# EAGLE design Brundage Business Card - REV 1.0 (EAGLE 9.0.1)
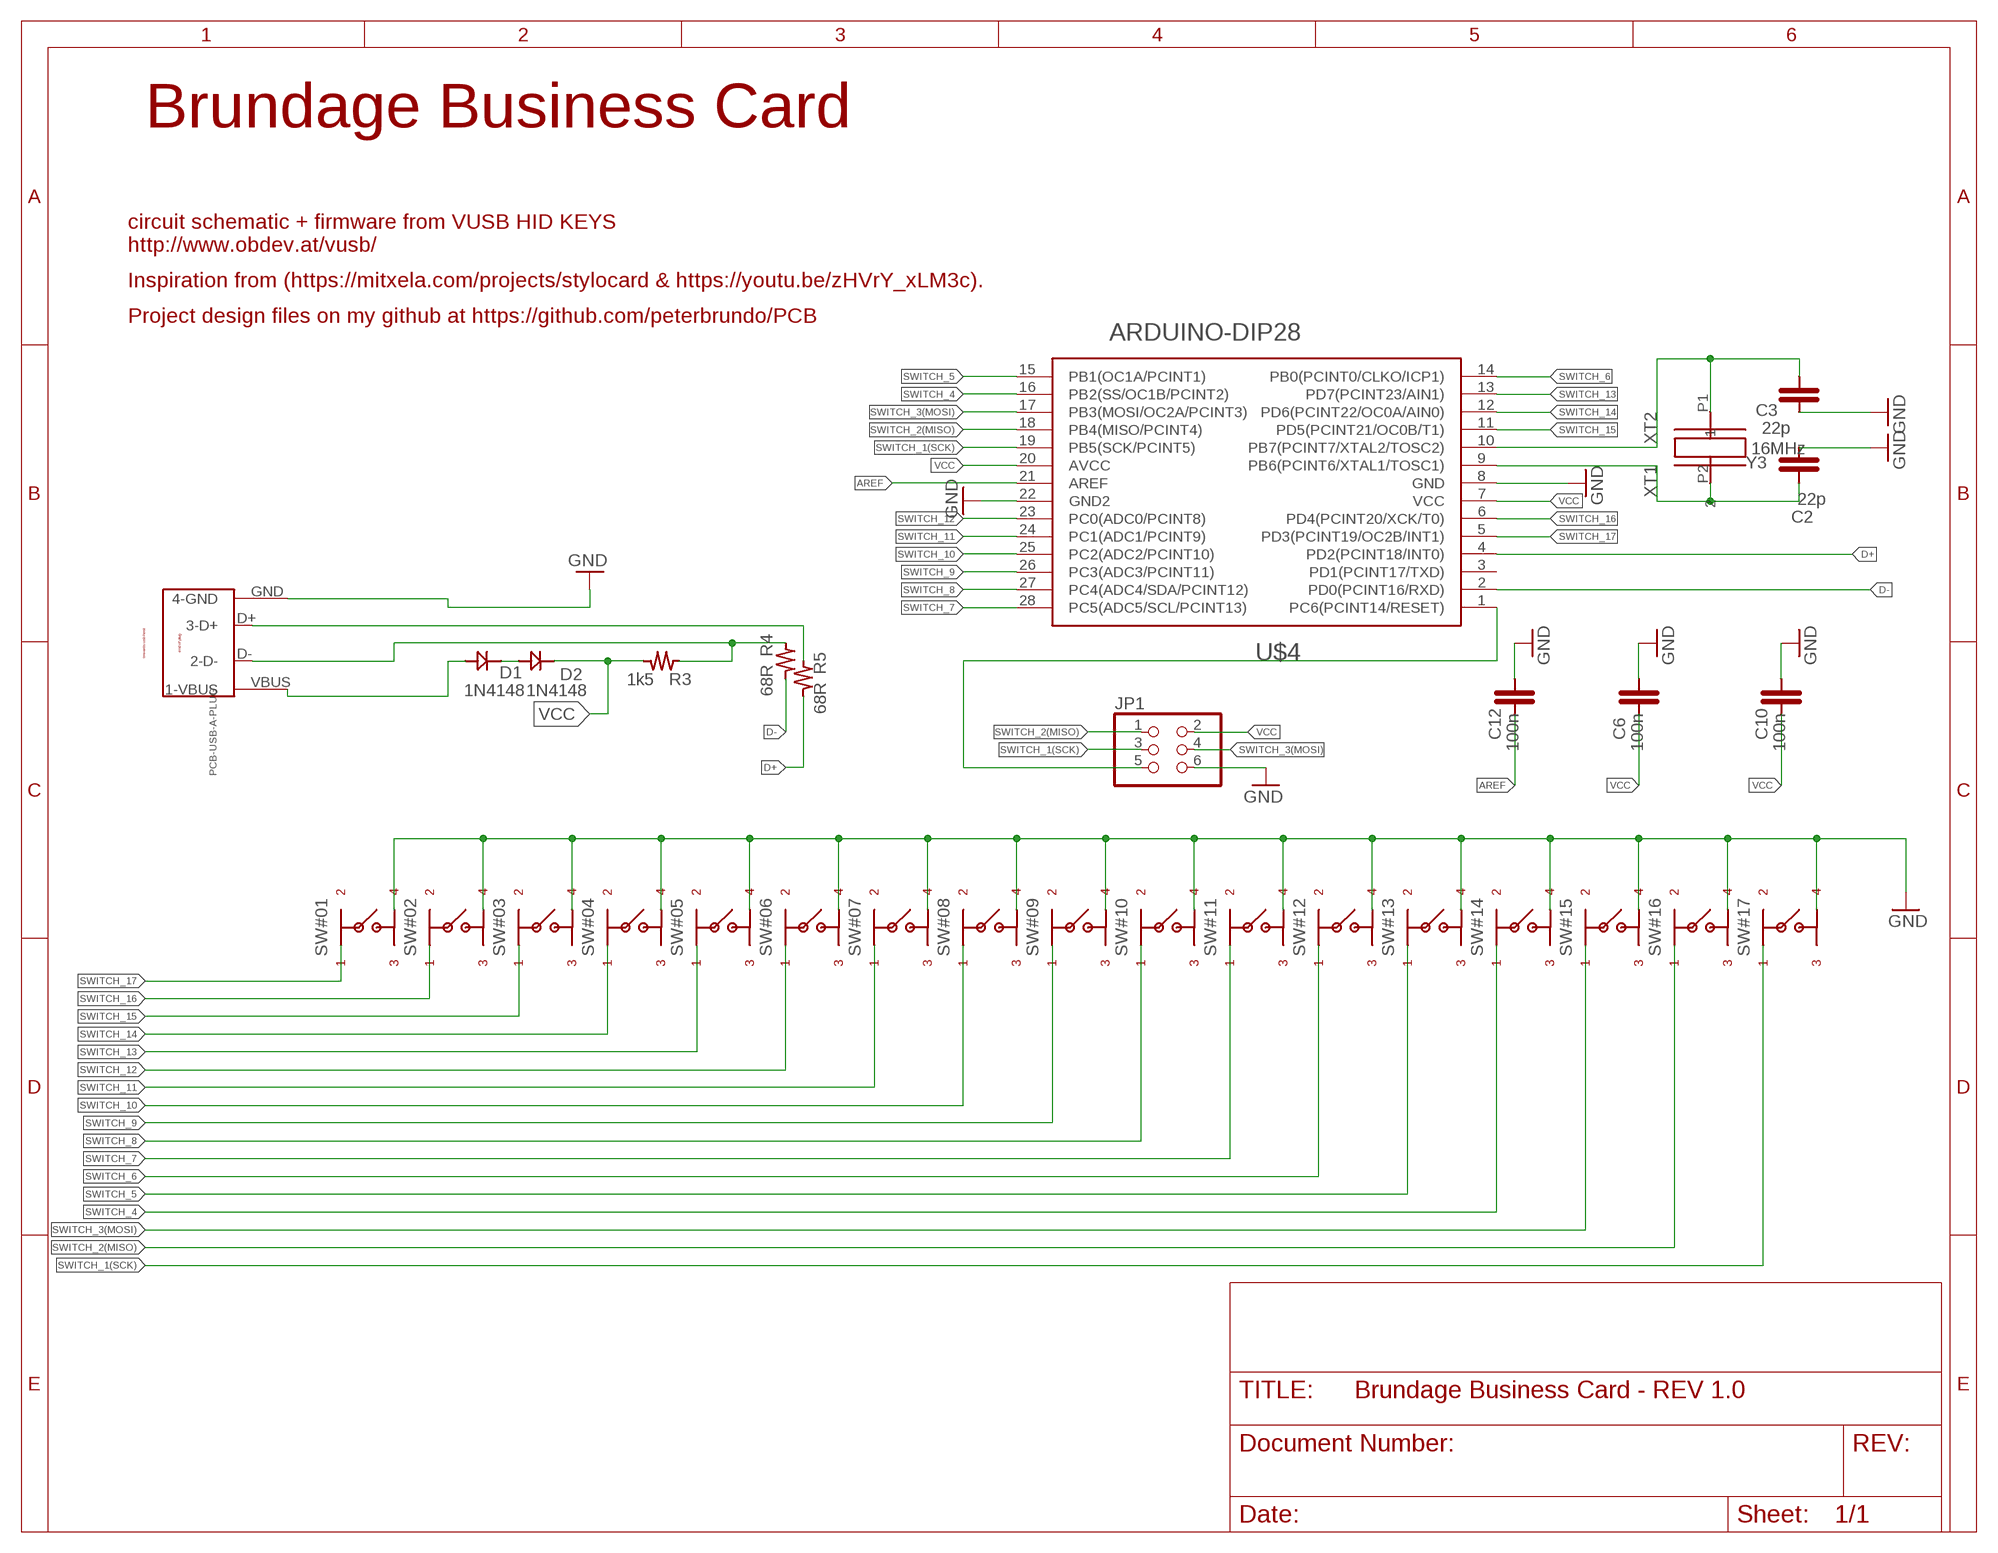
[diagram p0: schematic, sheet 1]

## Parts
C2  22p  GRM0225C1E220GA02L  [GRM0225C1E220GA02L]
C3  22p  GRM0225C1E220GA02L  [GRM0225C1E220GA02L]
C6  100n  GMK063BJ104KP-F  [GMK063BJ104KP-F]
C10  100n  GMK063BJ104KP-F  [GMK063BJ104KP-F]
C12  100n  GMK063BJ104KP-F  [GMK063BJ104KP-F]
D1  1N4148  [1N4148]
D2  1N4148  [1N4148]
JP1  PINHD-2X3  [2X03]
PCB-USB-A-PLUG  PCB/USB-SERIES"A"PLUG  [USB-SERIES-A-PLUG]
R3  1k5  CRCW06031K50FKEAC  [CRCW06031K50FKEAC]
R4  68R  RCS060368R0FKEA  [RCS060368R0FKEA]
R5  68R  RCS060368R0FKEA  [RCS060368R0FKEA]
SW#01  PTS647SM38SMTR2LFS  [PTS647SM38SMTR2LFS]
SW#02  PTS647SM38SMTR2LFS  [PTS647SM38SMTR2LFS]
SW#03  PTS647SM38SMTR2LFS  [PTS647SM38SMTR2LFS]
SW#04  PTS647SM38SMTR2LFS  [PTS647SM38SMTR2LFS]
SW#05  PTS647SM38SMTR2LFS  [PTS647SM38SMTR2LFS]
SW#06  PTS647SM38SMTR2LFS  [PTS647SM38SMTR2LFS]
SW#07  PTS647SM38SMTR2LFS  [PTS647SM38SMTR2LFS]
SW#08  PTS647SM38SMTR2LFS  [PTS647SM38SMTR2LFS]
SW#09  PTS647SM38SMTR2LFS  [PTS647SM38SMTR2LFS]
SW#10  PTS647SM38SMTR2LFS  [PTS647SM38SMTR2LFS]
SW#11  PTS647SM38SMTR2LFS  [PTS647SM38SMTR2LFS]
SW#12  PTS647SM38SMTR2LFS  [PTS647SM38SMTR2LFS]
SW#13  PTS647SM38SMTR2LFS  [PTS647SM38SMTR2LFS]
SW#14  PTS647SM38SMTR2LFS  [PTS647SM38SMTR2LFS]
SW#15  PTS647SM38SMTR2LFS  [PTS647SM38SMTR2LFS]
SW#16  PTS647SM38SMTR2LFS  [PTS647SM38SMTR2LFS]
SW#17  PTS647SM38SMTR2LFS  [PTS647SM38SMTR2LFS]
U$4  ARDUINO-DIP28  [DIL28-3]
Y3  16MHz  ABL-8.000MHZ-B2  [ABL-8.000MHZ-B2]

## Nets
AREF [aref]: C12.P2 U$4.21(AREF)
D+: R5.P2 U$4.4(PD2(PCINT18/INT0))
D-: R4.P2 U$4.2(PD0(PCINT16/RXD))
GND [gnd]: C2.P2 C3.P2 C6.P1 C10.P1 C12.P1 JP1.6 PCB-USB-A-PLUG.GND(4-GND) SW#01.4 SW#02.4 SW#03.4 SW#04.4 SW#05.4 SW#06.4 SW#07.4 SW#08.4 SW#09.4 SW#10.4 SW#11.4 SW#12.4 SW#13.4 SW#14.4 SW#15.4 SW#16.4 SW#17.4 U$4.8(GND) U$4.22(GND2)
N$25: PCB-USB-A-PLUG.D+(3-D+) R5.P1
N$27 [usbvcc]: PCB-USB-A-PLUG.D-(2-D-) R3.P1 R4.P1
N$28 [usbvcc]: D1.ANODE(+) PCB-USB-A-PLUG.VBUS(1-VBUS)
N$29 [usbvcc]: D1.CATHODE(-) D2.ANODE(+)
N$52: JP1.5 U$4.1(PC6(PCINT14/RESET))
SWITCH_1(SCK): JP1.3 SW#17.1 U$4.19(PB5(SCK/PCINT5))
SWITCH_2(MISO): JP1.1 SW#16.1 U$4.18(PB4(MISO/PCINT4))
SWITCH_3(MOSI): JP1.4 SW#15.1 U$4.17(PB3(MOSI/OC2A/PCINT3))
SWITCH_4: SW#14.1 U$4.16(PB2(SS/OC1B/PCINT2))
SWITCH_5: SW#13.1 U$4.15(PB1(OC1A/PCINT1))
SWITCH_6: SW#12.1 U$4.14(PB0(PCINT0/CLKO/ICP1))
SWITCH_7: SW#11.1 U$4.28(PC5(ADC5/SCL/PCINT13))
SWITCH_8: SW#10.1 U$4.27(PC4(ADC4/SDA/PCINT12))
SWITCH_9: SW#09.1 U$4.26(PC3(ADC3/PCINT11))
SWITCH_10: SW#08.1 U$4.25(PC2(ADC2/PCINT10))
SWITCH_11: SW#07.1 U$4.24(PC1(ADC1/PCINT9))
SWITCH_12: SW#06.1 U$4.23(PC0(ADC0/PCINT8))
SWITCH_13: SW#05.1 U$4.13(PD7(PCINT23/AIN1))
SWITCH_14: SW#04.1 U$4.12(PD6(PCINT22/OC0A/AIN0))
SWITCH_15: SW#03.1 U$4.11(PD5(PCINT21/OC0B/T1))
SWITCH_16: SW#02.1 U$4.6(PD4(PCINT20/XCK/T0))
SWITCH_17: SW#01.1 U$4.5(PD3(PCINT19/OC2B/INT1))
VCC [usbvcc]: C6.P2 C10.P2 D2.CATHODE(-) JP1.2 R3.P2 U$4.7(VCC) U$4.20(AVCC)
XT1: C2.P1 U$4.9(PB6(PCINT6/XTAL1/TOSC1)) Y3.P2
XT2: C3.P1 U$4.10(PB7(PCINT7/XTAL2/TOSC2)) Y3.P1
Unconnected: SW#01.2 SW#01.3 SW#02.2 SW#02.3 SW#03.2 SW#03.3 SW#04.2 SW#04.3 SW#05.2 SW#05.3 SW#06.2 SW#06.3 SW#07.2 SW#07.3 SW#08.2 SW#08.3 SW#09.2 SW#09.3 SW#10.2 SW#10.3 SW#11.2 SW#11.3 SW#12.2 SW#12.3 SW#13.2 SW#13.3 SW#14.2 SW#14.3 SW#15.2 SW#15.3 SW#16.2 SW#16.3 SW#17.2 SW#17.3 U$4.3(PD1(PCINT17/TXD))

## Notes on the sheet
- Brundage Business Card
- circuit schematic + firmware from VUSB HID KEYS 
  http://www.obdev.at/vusb/
- Inspiration from (https://mitxela.com/projects/stylocard & https://youtu.be/zHVrY_xLM3c).
- Project design files on my github at https://github.com/peterbrundo/PCB

## Library data of the parts
C2 C3 = Brundage Buisness Card:GRM0225C1E220GA02L
C6 C10 C12 = Brundage Buisness Card:GMK063BJ104KP-F
D1 D2 = Brundage Buisness Card:1N4148
JP1 = pinhead:PINHD-2X3: PIN HEADER
PCB-USB-A-PLUG = Brundage Buisness Card:PCB/USB-SERIES"A"PLUG
R3 = Brundage Buisness Card:CRCW06031K50FKEAC
R4 R5 = Brundage Buisness Card:RCS060368R0FKEA
SW#01-SW#09 SW#10-SW#17 = Brundage Buisness Card:PTS647SM38SMTR2LFS
U$4 = Brundage Buisness Card:ARDUINO-DIP28
Y3 = Brundage Buisness Card:ABL-8.000MHZ-B2

## Net classes
0 default: clearance 0.152 mm
2 gnd: width 0.025 mm, drill 0.559 mm, clearance 0.152 mm to class 0, clearance 0.152 mm
3 usbvcc: width 0.025 mm, drill 0.61 mm, clearance 0.152 mm to class 0, clearance 0.254 mm
4 aref: width 0.025 mm, drill 0.61 mm, clearance 0.152 mm to class 0, clearance 0.254 mm
6 lol text: clearance 0.152 mm to class 0, clearance 0.127 mm

## Board
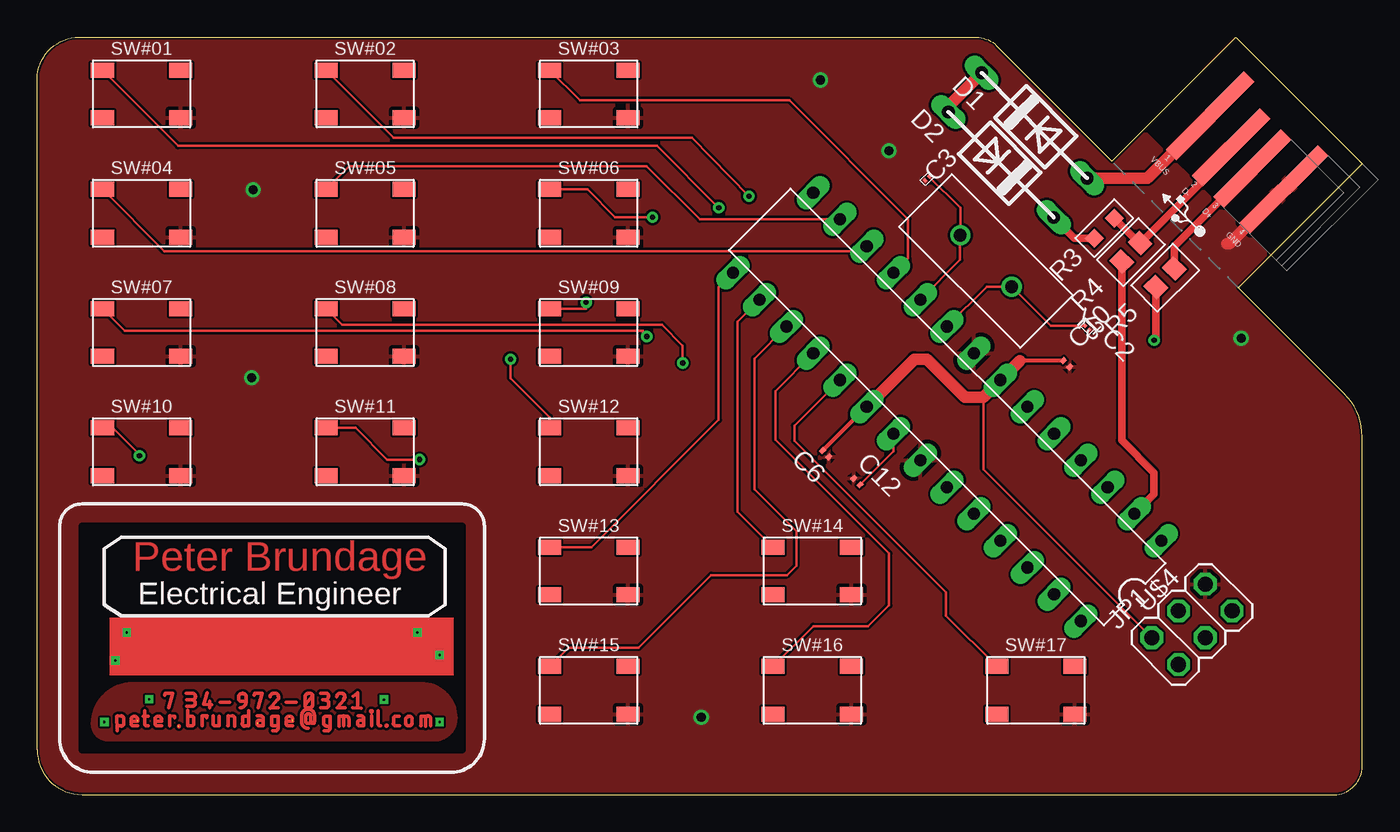
[diagram p1: board, top side]
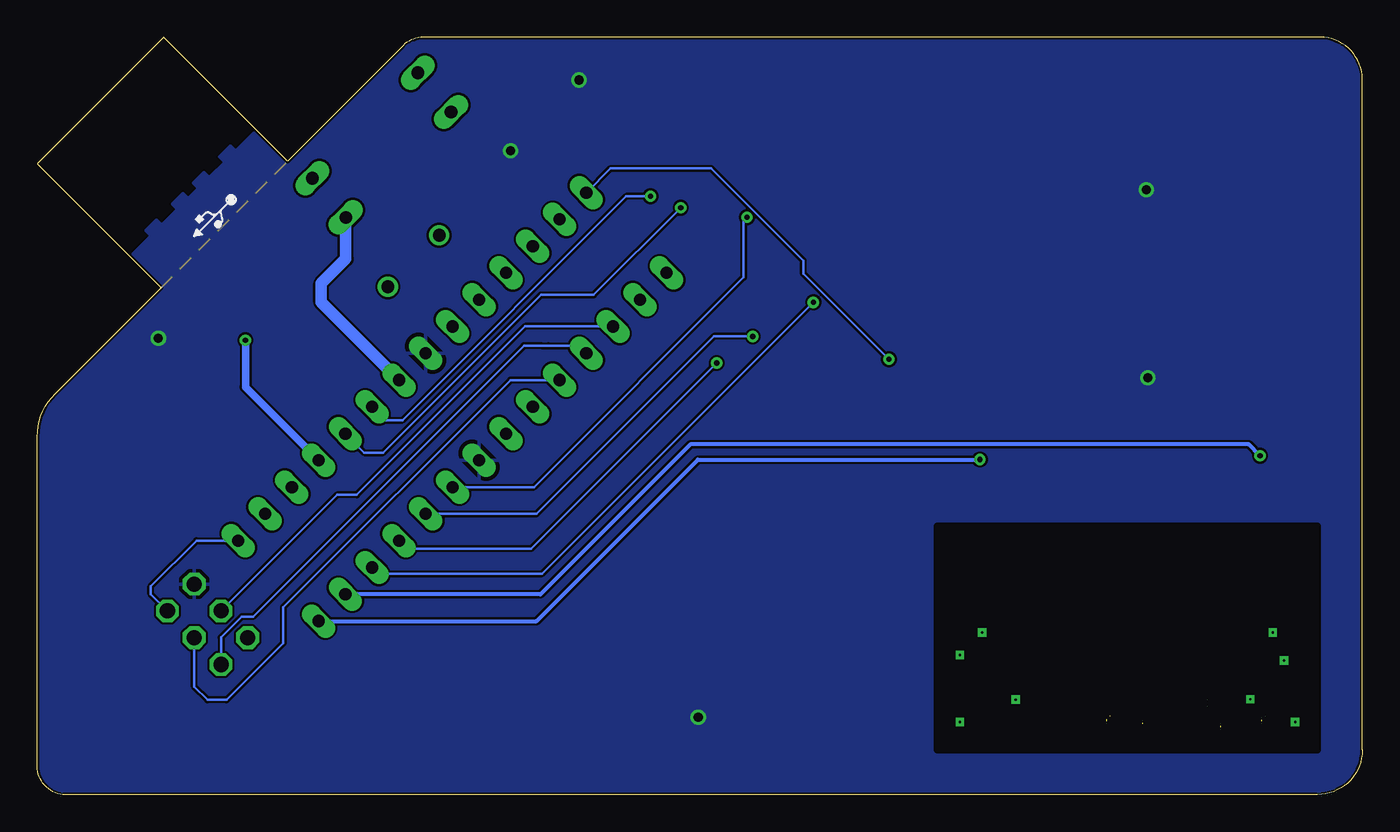
[diagram p2: board, bottom side, seen from below]

Size 88.9 x 50.8 mm. Coordinates in mm from the lower left corner, seen from the top.
Outline: 0,3 0,48 arc-90 2.8,50.8 63,50.8 arc-45 64.36,50.24 72.11,42.49 80.42,50.8 88.9,42.31 80.59,34.01 87.7,26.9 arc-45 88.9,24 88.9,1.9 arc-90 87,0 3,0 arc-90 0,3
Copper layers (1*16): Top 0.035mm / dielectric 1.5mm / Bottom 0.035mm
Design rules "default *": minimum track width 6mil, minimum drill 0.35mm, track to track 6mil, track to pad 6mil, pad to pad 6mil, via to via 6mil, smd to smd 6mil, copper to edge 6mil, drill to drill 6mil, minimum pad ring 10mil, minimum via ring 8mil, stop-mask expansion 4mil, vias tented up to drill 0mil, thermal gap 10mil
tRestrict: 4 lines
bRestrict: 4 lines

### Footprints (pad centres in the part's own frame; a part is rotated, then mirrored left to right if it is on the bottom)
GRM0225C1E220GA02L = smd 0.18 x 0.23: P1 -0.09,0; P2 0.29,0
GMK063BJ104KP-F = smd 0.3 x 0.4: P1 -0.3,0; P2 0.3,0
1N4148 = drill 0.85 long: ANODE(+) 0,0; CATHODE(-) 10,0
2X03 = drill 1.016 octagon: 1 -2.54,-1.27; 2 -2.54,1.27; 3 0,-1.27; 4 0,1.27; 5 2.54,-1.27; 6 2.54,1.27
USB-SERIES-A-PLUG = smd 1 x 6.41: D+ 5,-6.305; D- 7,-6.305 | smd 1 x 7.41: GND 2.5,-6.805; VBUS 9.5,-6.805
CRCW06031K50FKEAC = smd 0.9 x 0.9: P1 -0.95,0; P2 0.95,0
RCS060368R0FKEA = smd 1.1 x 1.25: P1 0,0; P2 1.75,0
PTS647SM38SMTR2LFS = smd 1.55 x 1: 1 -2.625,1.6; 2 2.625,1.6; 3 -2.625,-1.6; 4 2.625,-1.6
DIL28-3 = drill 0.813 long: 1 -16.51,-3.81; 2 -13.97,-3.81; 3 -11.43,-3.81; 4 -8.89,-3.81; 5 -6.35,-3.81; 6 -3.81,-3.81; 7 -1.27,-3.81; 8 1.27,-3.81; 9 3.81,-3.81; 10 6.35,-3.81; 11 8.89,-3.81; 12 11.43,-3.81; 13 13.97,-3.81; 14 16.51,-3.81; 15 16.51,3.81; 16 13.97,3.81; 17 11.43,3.81; 18 8.89,3.81; 19 6.35,3.81; 20 3.81,3.81; 21 1.27,3.81; 22 -1.27,3.81; 23 -3.81,3.81; 24 -6.35,3.81; 25 -8.89,3.81; 26 -11.43,3.81; 27 -13.97,3.81; 28 -16.51,3.81
ABL-8.000MHZ-B2 = drill 0.85: P1 -2.44,0; P2 2.44,0

### Placement (x,y rotation side)
C2  70.38,31.38 315 top
C3  59.78,41.4 225 top
C6  52.9,22.86 135 top
C10  69.06,28.9 135 top
C12  55,21 315 top
D1  70.44,41.35 135 top
D2  61.13,45.79 315 top
JP1  77.47,11.43 45 top
PCB-USB-A-PLUG  80.59,34.01 135 top
R3  71.59,38 225 top
R4  74,37 225 top
R5  76.29,35.29 225 top
SW#01  7,47 0 top
SW#02  22,47 0 top
SW#03  37,47 0 top
SW#04  7,39 0 top
SW#05  22,39 0 top
SW#06  37,39 0 top
SW#07  7,31 0 top
SW#08  22,31 0 top
SW#09  37,31 0 top
SW#10  7,23 0 top
SW#11  22,23 0 top
SW#12  37,23 0 top
SW#13  37,15 0 top
SW#14  52,15 0 top
SW#15  37,7 0 top
SW#16  52,7 0 top
SW#17  67,7 0 top
U$4  61.04,26.01 135 top
Y3  63.66,35.79 315 top

### Tracks (layer width: path | path; a pad name or v marks a point on that pad's centre or on a via)
AREF
  Top 0.152: C12.P2 57.45,23.03 U$4.21
D+  (via drill 0.35)
  Top 0.152: 75.06,30.61 v74.93,30.48
  Top 0.508: R5.P2 75.06,30.61
  Bottom 0.508: v74.93,30.48 74.93,27.33 U$4.4
D-
  Top 0.508: R4.P2 72.76,23.76 74.93,21.59 74.93,20.14 U$4.2
GND  (via drill 0.61)
  Top 0.762: PCB-USB-A-PLUG.GND 79.98,36.94 79.81,36.94
  other vias: 57.15,43.18 80.77,30.61 14.39,27.97 14.48,40.58 52.55,47.94 44.55,5.19
  pour Top: -9,54 -9,-9 96,-9 96,-3 88.88,54
  pour Bottom: -10.57,61.26 -10.57,-13.67 115.16,-13.67 115.16,61.26
LOOOOL
  pour Top: 25.77,7.49 6.4,7.49 arc90 3.67,4.76 arc90 4.79,3.64 26.62,3.64 arc90 28.12,5.14 arc90
N$1  (via drill 0.15)
  other vias: 27,9.38
N$2  (2 unrouted)
  Top 0.25: 9.53,4.62 9.49,4.62 arc90 9.48,4.61 | 9.48,4.57 arc90 9.5,4.55 | 9.52,4.55 arc90 9.53,4.56
N$3  (via drill 0.15)
  other vias: 4.5,4.88
N$4  (via drill 0.15)
  other vias: 27,4.88
N$5  (via drill 0.15)
  other vias: 23.25,6.38
N$6  (via drill 0.15)
  other vias: 25.5,10.88
N$7  (via drill 0.15)
  other vias: 5.25,9
N$8
  Top 0.25: 14.56,6.66 14.57,6.79 15.1,6.8 14.83,5.82
N$9  (via drill 0.15)
  other vias: 7.51,6.39
N$10  (2 unrouted)
  Top 0.25: 10,6.8 10.4,6.8 | 10.01,6.37 10.4,6.37 | 10.4,6.8 arc-180 10.4,6.37 | 10.4,6.8 arc-180 10.4,6.37 | 10.39,6.36 arc-180 10.39,5.93 | 10.01,5.93 10.4,5.93
N$11
  Top 0.25: 11.4,6.84 11.18,6.05 11.71,6.04 11.52,6.05 11.56,6.05 | 11.56,6.05 11.56,6.25 | 11.56,6.05 11.56,5.84
N$12
  Top 0.25: 12.27,6.2 12.92,6.2
N$13
  Top 0.25: 8.56,6.66 8.57,6.79 9.1,6.8 8.83,5.82
N$14
  Top 0.25: 15.61,5.83 16.16,5.83
N$15
  Top 0.25: 15.62,5.81 16.11,6.36
N$16
  Top 0.25: 16.71,6.21 17.38,6.2
N$17
  Top 0.25: 18.44,6.59 18.01,6.05
N$18  (2 unrouted)
  Top 0.25: 6.73,5.04 arc90 6.52,5.25 | 6.5,5.25 arc90 6.29,5.04 | 6.73,4.61 6.45,4.61 arc-90 6.29,4.77 6.29,4.93 6.74,4.93
N$19  (2 unrouted)
  Top 0.25: 17.14,5.05 arc90 16.93,5.26 | 16.91,5.26 arc90 16.7,5.05 | 17.14,4.62 16.86,4.62 arc-90 16.7,4.78 16.7,4.94 17.15,4.94
N$20
  Top 0.25: 16.15,5.27 16.15,4.45 arc-90 15.99,4.29 15.78,4.29
N$21
  Top 0.25: 16.14,4.63 15.88,4.63
N$22
  Top 0.25: 15.83,4.63 arc-90 15.71,4.75 15.71,5.14 arc-90 15.83,5.26 16.14,5.26
N$23
  Top 0.25: 18.22,6.8 arc90 17.97,6.55 17.97,5.97 arc90 18.12,5.82 18.26,5.82 arc90 18.47,6.03 18.47,6.65 arc90 18.33,6.79 18.13,6.79
N$24  (via drill 0.15)
  other vias: 6,10.88
N$25
  Top 0.508: PCB-USB-A-PLUG.D+ 76.29,36.78 R5.P1
N$26
  Top 0.25: 8.34,5.05 arc90 8.13,5.26 8.11,5.26 arc90 7.9,5.05 7.9,4.94 | 7.9,4.94 7.9,4.78 arc90 8.06,4.62 8.34,4.62 | 8.35,4.94 7.9,4.94
N$27
  Top 0.152: 73.93,37 R4.P1 | PCB-USB-A-PLUG.D- 80.1,43.1
  Top 0.508: R3.P1 73.93,37 | 80.1,43.1 R4.P1
N$28
  Top 0.762: PCB-USB-A-PLUG.VBUS 74.5,41.35 D1.ANODE(+)
N$29
  Top 0.508: 61.13,46.18 D2.ANODE(+)
  Top 0.762: D1.CATHODE(-) 61.13,46.18
N$30
  Top 0.25: 14.2,5.63 14.2,4.62
N$31
  Top 0.25: 14.18,4.63 13.94,4.62
N$32
  Top 0.25: 13.77,4.81 13.77,5.09
N$33
  Top 0.25: 13.91,5.26 14.19,5.27
N$34
  Top 0.25: 13.71,6.25 14.01,6.26 14.02,6.52
N$37
  Top 0.25: 12.81,5.28 12.8,4.61 12.81,4.62 12.79,4.61
N$38
  Top 0.25: 13.24,4.58 13.24,5.1
N$39
  Top 0.25: 13.07,5.28 12.81,5.27
N$40
  Top 0.25: 12.22,5.27 12.22,4.62 11.95,4.62
N$41
  Top 0.25: 11.79,5.31 11.79,4.78 11.79,4.77 arc90 11.95,4.61
N$42
  Top 0.25: 11.07,5.28 11.06,4.62
N$43
  Top 0.25: 11.38,5.27 11.38,5.16
N$44
  Top 0.25: 11.4,5.28 11.06,5.28
N$45
  Top 0.25: 10.08,5.65 10.09,4.63
N$46
  Top 0.25: 10.09,4.61 10.34,4.61
N$47
  Top 0.25: 10.51,4.8 10.51,5.09
N$48
  Top 0.25: 10.11,5.27 10.34,5.26
N$49
  Top 0.25: 8.9,5.28 8.89,4.63
N$50
  Top 0.25: 8.93,5.28 9.2,5.27
N$51
  Top 0.25: 9.23,5.25 9.22,5.16
N$52
  Bottom 0.152: JP1.5 81.28,13.44 81.28,13.97 78.22,17.03 U$4.1
N$56
  Top 0.25: 7.22,5.62 7.22,4.75 arc90 7.35,4.62
N$57
  Top 0.25: 7.38,4.63 7.43,4.63
N$58
  Top 0.25: 7.1,5.27 7.43,5.27
N$62
  Top 0.25: 5.34,5.27 5.35,4.29
N$63
  Top 0.25: 5.35,4.63 5.63,4.62
N$64
  Top 0.25: 5.79,4.78 5.79,5.08
N$65
  Top 0.25: 5.39,5.28 5.63,5.27
N$66
  Top 0.25: 5.63,5.28 arc-90 5.79,5.12 5.79,5.11
N$67
  Top 0.25: 5.63,4.6 arc90 5.81,4.78
N$73
  Top 0.25: 10.35,4.62 10.36,4.62 arc90 10.51,4.77
N$74
  Top 0.25: 10.51,5.1 10.51,5.11 arc90 10.36,5.26
N$75
  Top 0.25: 13.09,5.28 arc-90 13.25,5.12 13.25,5.11
N$76
  Top 0.25: 13.9,4.6 arc-90 13.76,4.74 13.76,4.78
N$77
  Top 0.25: 13.77,5.1 13.77,5.14 arc-90 13.89,5.26
N$78
  Top 0.25: 13.7,6.26 arc-90 13.5,6.46 13.5,6.52 arc-90 13.77,6.79 13.78,6.79 arc-90 14.02,6.55
N$79
  Top 0.25: 14.01,6.23 arc-90 13.6,5.82
N$80
  Top 0.25: 15.61,6.56 arc-90 15.84,6.79 16,6.79 arc-90 16.17,6.62 arc90 16.18,6.61 16.18,6.45 arc-90 16.1,6.37
N$81
  Top 0.25: 18.16,4.45 18.15,4.45 arc-90 17.74,4.86 17.74,5.31 arc-90 18.17,5.74 18.18,5.74 arc-90 18.58,5.34
N$82
  Top 0.25: 18.6,5.32 18.6,4.92 arc-90 18.59,4.91
N$83
  Top 0.25: 18.59,4.9 18.59,4.79 arc-90 18.58,4.78 18.49,4.78 arc-90 18.34,4.93 18.34,5.28 arc90 18.19,5.43 arc90 18.02,5.26 18.02,4.89 arc90 18.13,4.78 18.26,4.78
N$84
  Top 0.25: 19.26,4.28 19.46,4.28 arc90 19.64,4.46 19.64,5.23 arc90 19.62,5.25 19.35,5.25 arc90 19.2,5.1 19.2,4.8 arc90 19.37,4.63
N$85
  Top 0.25: 19.41,4.6 19.59,4.6 arc90 19.61,4.62
N$86
  Top 0.25: 20.26,4.59 20.26,5.25 arc-90 20.27,5.26
N$87
  Top 0.25: 20.26,5.26 20.76,5.26 arc-90 20.9,5.12
N$88
  Top 0.25: 20.91,5.09 20.91,4.62 arc-90 20.9,4.61
N$89
  Top 0.25: 20.56,5.28 20.56,4.62
N$90
  Top 0.25: 21.52,5.28 21.74,5.28 arc-90 21.91,5.11 21.91,4.63 arc-90 21.9,4.62
N$91
  Top 0.25: 21.9,4.61 21.65,4.61 arc-90 21.49,4.77 21.49,4.83 arc-90 21.66,5 21.87,5 arc-90 21.89,4.98
N$92
  Top 0.25: 22.43,5.29 22.43,4.63
N$93
  Top 0.25: 22.36,5.62 arc90 22.45,5.53 22.45,5.54 arc-90 22.47,5.56 22.47,5.58 arc90 22.46,5.59 arc90 22.42,5.63 22.42,5.62
N$94
  Top 0.25: 22.87,5.62 22.87,4.78 arc90 23.04,4.61
N$95
  Top 0.25: 23.42,4.63 23.42,4.64 arc-90 23.45,4.67 23.41,4.67 arc90 23.4,4.66 23.4,4.62 arc90 23.42,4.6 23.44,4.6 arc90 23.45,4.61 23.45,4.63 arc-90 23.46,4.64
N$96
  Top 0.25: 24.3,4.62 24.04,4.62 arc-90 23.89,4.77
N$97
  Top 0.25: 23.9,4.78 23.9,5.11 arc-90 24.05,5.26 24.28,5.26
N$98
  Top 0.25: 24.72,5.07 24.72,5.05 | 24.72,5.05 24.72,4.83 arc90 24.94,4.61 arc90 25.14,4.81 25.14,5.09 arc90 24.98,5.25 24.92,5.25 arc90 24.72,5.05
N$99
  Top 0.25: 25.73,4.62 arc90 25.74,4.63 25.74,5.27 26.28,5.27 arc-90 26.29,5.26
N$100
  Top 0.25: 26.04,4.59 26.04,5.26
N$101
  Top 0.25: 26.2,5.29 arc-90 26.39,5.1 26.39,4.61
N$102
  Top 0.25: 19.01,6.81 19.36,6.81 arc-90 19.54,6.63 arc-90 19.26,6.35 | 19.26,6.35 19.14,6.35 | 19.26,6.35 19.32,6.35 arc-90 19.56,6.11
N$103
  Top 0.25: 19,5.82 19.34,5.82 arc90 19.56,6.04
N$104
  Top 0.25: 20.67,5.82 20.12,5.82 arc-90 20.11,5.83
N$105
  Top 0.25: 20.1,6.58 arc-90 20.33,6.81 20.39,6.81
N$106
  Top 0.25: 20.62,6.6 20.62,6.63 arc90 20.46,6.79
N$107
  Top 0.25: 20.58,6.36 20.11,5.82
N$108
  Top 0.25: 20.57,6.39 20.64,6.57
N$109
  Top 0.25: 21.2,6.6 21.46,6.8
N$110
  Top 0.25: 21.49,6.83 21.48,5.82
N$111
  Top 0.25: 21.73,5.81 21.17,5.82
N$112
  Top 0.25: 14.77,5.28 14.99,5.28 arc-90 15.16,5.11 15.16,4.63
N$113  (1 unrouted)
  Top 0.25: 15.15,4.61 14.9,4.61 arc-90 14.74,4.77 | 14.74,4.83 arc-90 14.91,5 15.12,5
SWITCH_1(SCK)
  Top 0.152: SW#17.1 60.96,12.02 60.96,13.59 50.8,23.75 50.8,24.75 U$4.19
  Bottom 0.152: U$4.19 57.15,27.81 72.39,12.57 72.39,10.16 76.2,6.35 77.47,6.35 78.37,7.25 JP1.3 | JP1.3
SWITCH_2(MISO)
  Top 0.152: SW#16.1 52.08,11.3 55.75,11.3 57.15,12.7 57.15,16.19 49.53,23.81 49.53,27.07 U$4.18
  Bottom 0.152: U$4.18 52.57,30.11 54.61,30.11 55.07,30.11 56.25,30.11 74.42,11.94 75.18,11.94 76.57,10.55 JP1.1
SWITCH_3(MOSI)
  Top 0.152: SW#15.1 35.65,9.87 40.35,9.87 45.21,14.73 50.29,14.73 50.93,15.37 50.93,17.65 48.11,20.47 48.11,29.24 U$4.17
  Bottom 0.152: U$4.17 56.17,31.4 67.47,20.1 68.8,20.1 JP1.4
SWITCH_4
  Top 0.152: SW#14.1 46.99,18.98 46.99,31.72 U$4.16
SWITCH_5
  Top 0.152: SW#13.1 37.17,16.6 45.72,25.15 45.72,34.04 U$4.15
SWITCH_6  (via drill 0.35)
  Top 0.152: SW#12.1 34.38,25.32 31.75,27.94 v31.75,29.21
  Bottom 0.152: v31.75,29.21 37.49,34.95 37.49,35.81 43.69,42.01 50.44,42.01 U$4.14
SWITCH_7  (via drill 0.35)
  Top 0.152: SW#11.1 21.35,24.6 23.47,22.48 v25.65,22.48
  Bottom 0.254: U$4.28 55.41,11.65 44.58,22.48 v25.65,22.48 | v25.65,22.48
SWITCH_8  (via drill 0.35)
  Top 0.152: SW#10.1 5.08,24.6 6.9,22.78 v6.86,22.73
  Bottom 0.254: v6.86,22.73 7.62,23.5 45.09,23.5 55.14,13.44 U$4.27
SWITCH_9  (via drill 0.35)
  Top 0.152: SW#09.1 36.83,32.6 v36.83,33.02
  Bottom 0.152: U$4.26 66.03,14.83 55.02,14.83 v36.83,33.02
SWITCH_10  (via drill 0.35)
  Top 0.152: SW#08.1 20.45,31.52 41.91,31.52 43.31,30.12 v43.31,28.96
  Bottom 0.152: U$4.25 64.11,16.51 55.75,16.51 v43.31,28.96
SWITCH_11  (via drill 0.35)
  Top 0.152: SW#07.1 5.86,31.11 40.64,31.11 40.64,30.99 v40.89,30.73
  Bottom 0.152: U$4.24 55.41,18.83 43.5,30.73 v40.89,30.73
SWITCH_12  (via drill 0.35)
  Top 0.152: v41.27,38.73 38.78,38.73 36.91,40.6 SW#06.1
  Bottom 0.152: v41.27,38.73 41.51,38.5 41.51,34.69 55.57,20.63 U$4.23
SWITCH_13
  Top 0.152: U$4.13 44.46,38.59 40.88,42.16 20.94,42.16 SW#05.1
SWITCH_14
  Top 0.152: SW#04.1 8.53,36.45 55.31,36.45 U$4.12
SWITCH_15
  Top 0.152: SW#03.1 36.41,46.57 50.46,46.57 58.42,38.61 58.42,35.96 U$4.11
SWITCH_16  (via drill 0.35)
  Top 0.152: v47.75,40.13 43.92,44.07 23.91,44.07 SW#02.1
  Bottom 0.152: v47.75,40.13 49.39,40.13 64.4,25.12 65.54,25.12 U$4.6
SWITCH_17  (via drill 0.35)
  Top 0.152: v45.72,39.37 41.57,43.52 9.46,43.52 SW#01.1
  Bottom 0.152: v45.72,39.37 51.56,33.53 55.11,33.53 65.69,22.95 66.96,22.95 U$4.5
VCC
  Top 0.152: JP1.2 63.49,21.81 63.49,26.67
  Top 0.254: C6.P2 55.63,26.01 U$4.20 | C10.P2 65.94,29.11
  Top 0.508: D2.CATHODE(-) 69.59,37.33 R3.P2
  Top 0.762: U$4.20 58.85,29.21 59.69,29.21 62.23,26.67 63.49,26.67 U$4.7 65.94,29.11
  Bottom 0.762: U$4.7 69.85,33.03 69.85,34.29 68.2,35.94 D2.CATHODE(-)
XT1
  Top 0.152: C2.P1 68,31.45 Y3.P2 63.71,34.07 U$4.9
XT2
  Top 0.152: C3.P1 61.93,39.37 Y3.P1 61.92,37.51 61.92,35.87 U$4.10
(copper drawn outside any net)
  shapes: Top area x1

### Text on the board
Top: Peter Brundage
tPlace: Electrical Engineer
tStop: Peter Brundage | Passion for PCB design and / Interest in Embedded Design
Measures: 35.5√(2)/2 = 17.75√(2) | 23.75√(2)/2 = 11.875√(2) | 11.75√(2)/2 = 5.875√(2) | 11.75√(2)/2 | 12√(2)/2 | 11.75 | 11.75 | 11.75√(2)/2 | 12 | 17.75√(2) | 12 | 11.75 | 80.41471862576144 / 50.8 | 11.75√(2)/2 | 63.797709267877565 / 50.8 | 88.9 / 42.31471862576143 | 11.75 | 72.10621394682 / 42.49149532105806 | 80.59149532105808 / 34.00621394681949 | 88.9 / 25.69770926787756